# EAGLE design HominiPulseSensor (EAGLE 8.0.1)
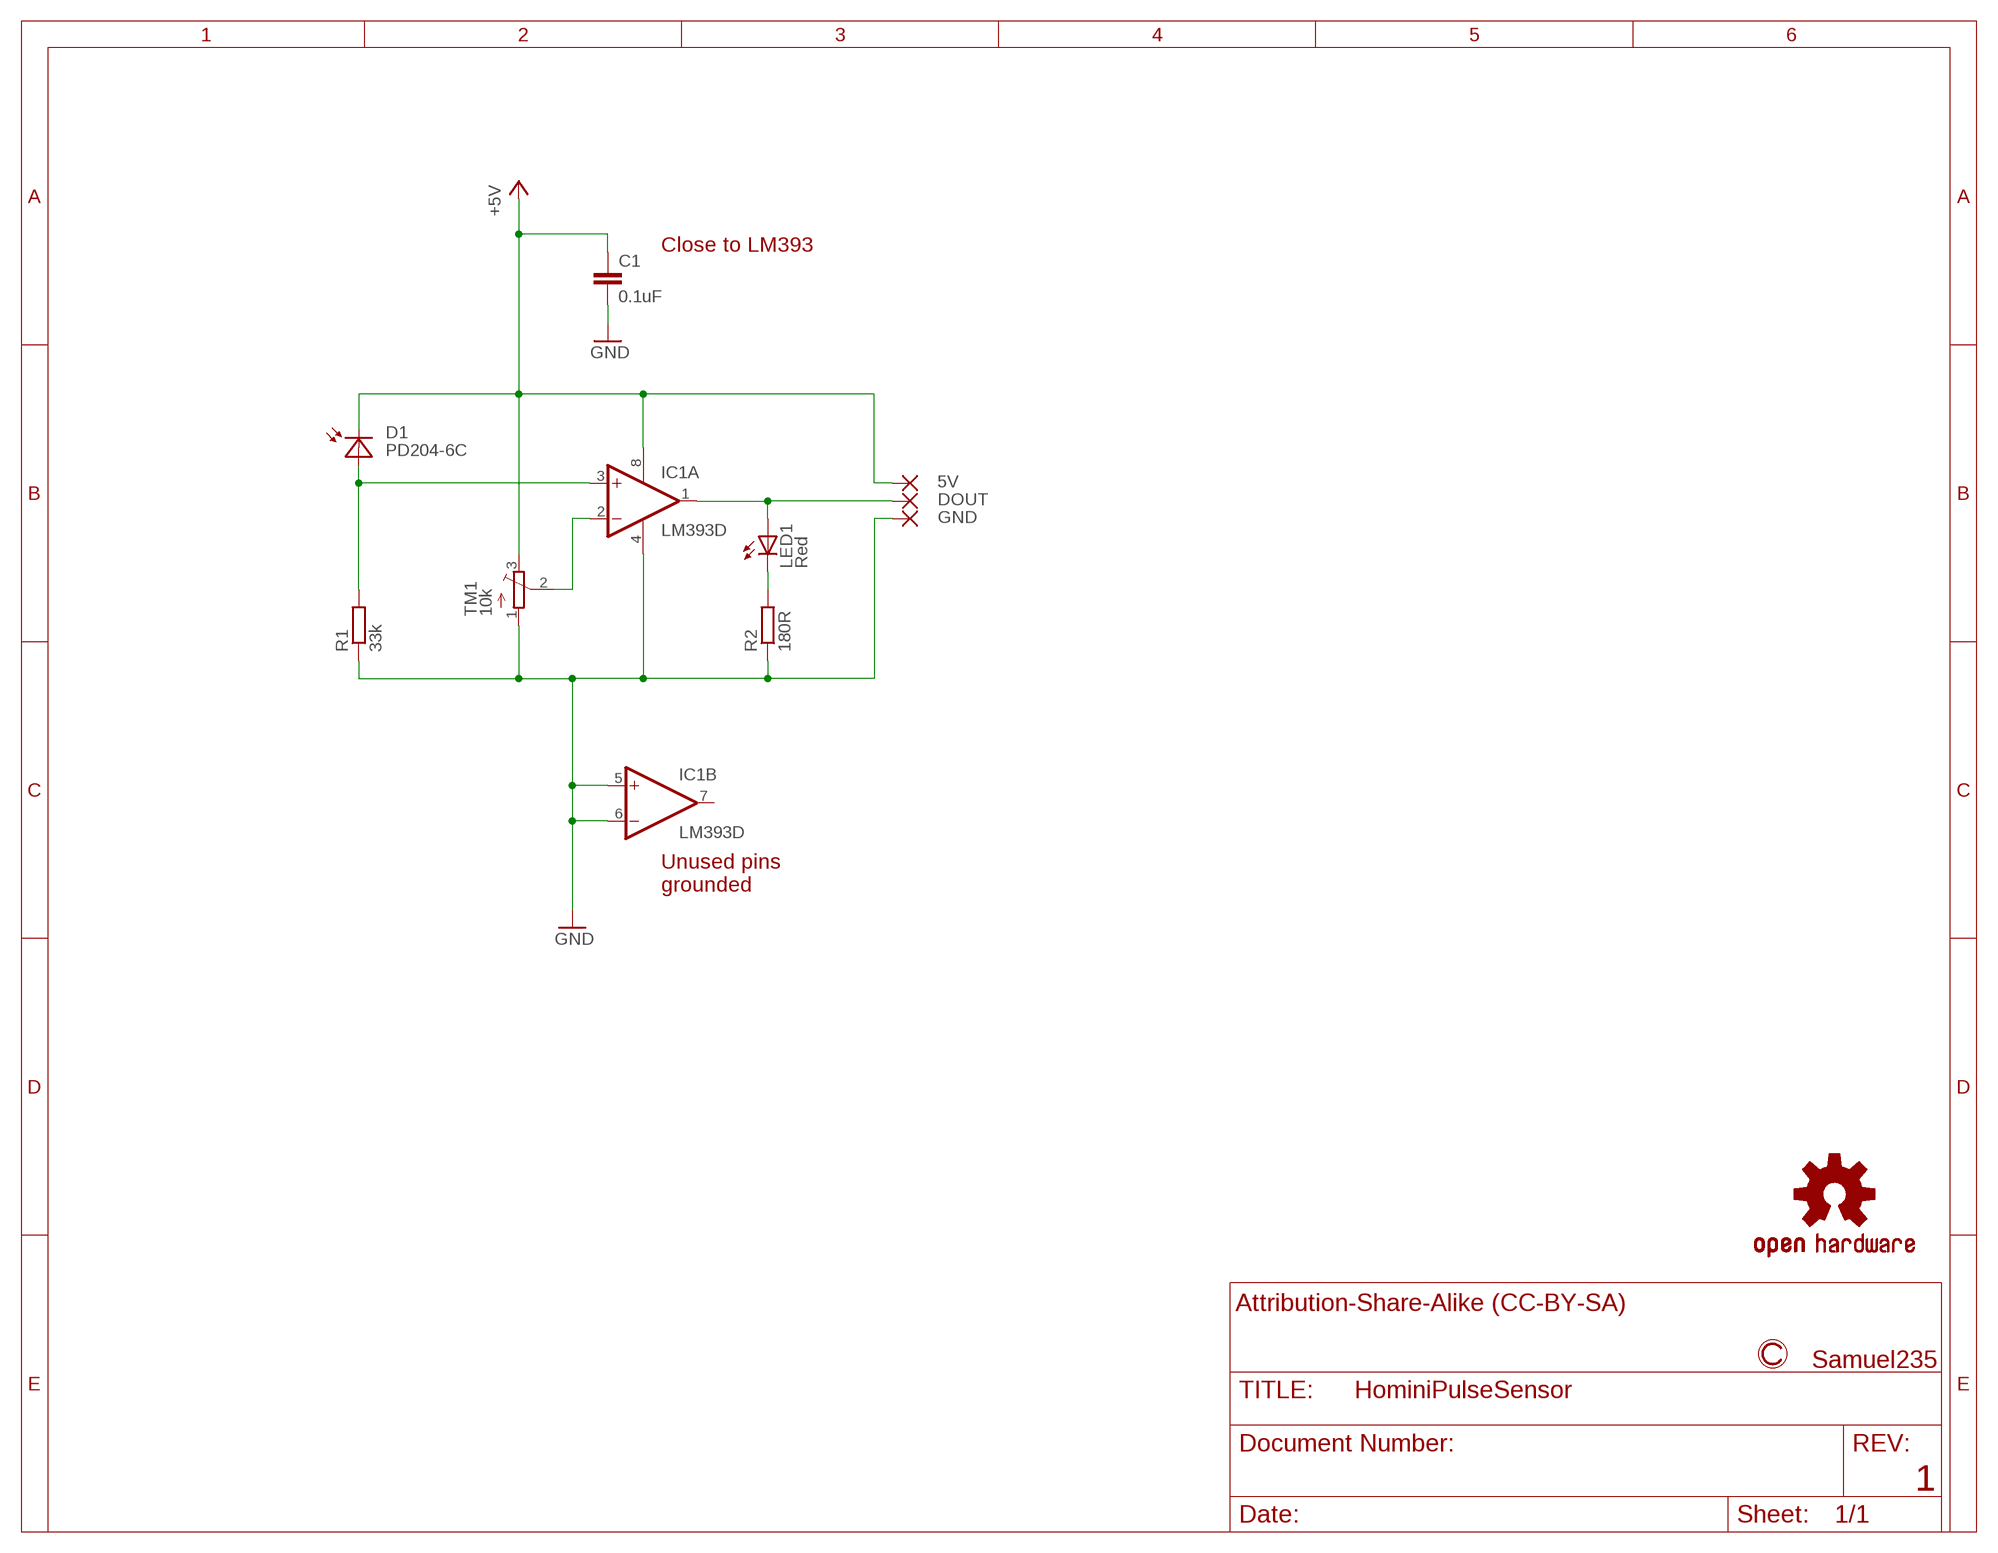
[diagram p0: schematic, sheet 1]

## Parts
5V  SMD2  [SMD1,27-2,54]
C1  0.1uF  C-EUC0603  [C0603]
D1  PD204-6C  [3MM-PTH]
DOUT  SMD2  [SMD1,27-2,54]
GND  SMD2  [SMD1,27-2,54]
IC1  LM393D  [SO08]
LED1  Red  LED3MM  [LED3MM]
LOGO1  OSHW-LOGOS  [OSHW-LOGO-S]
R1  33k  R-EU_R0603  [R0603]
R2  180R  R-EU_R0603  [R0603]
TM1  10k  TRIMPOTTC33X  [TC33X]

## Nets
+5V: 5V.1(P) C1.1 D1.C IC1.8(P:V+) TM1.3(E)
GND: C1.2 GND.1(P) IC1.4(P:V-) IC1.5(B:+IN) IC1.6(B:-IN) R1.1 R2.1 TM1.1(A)
N$1: D1.A IC1.3(A:+IN) R1.2
N$2: IC1.2(A:-IN) TM1.2(S)
N$4: DOUT.1(P) IC1.1(A:OUT) LED1.A
N$5: LED1.K(C) R2.2
Unconnected: IC1.7(B:OUT)

## Notes on the sheet
- Close to LM393
- Unused pins 
  grounded
- Attribution-Share-Alike (CC-BY-SA)
- Samuel235
- 1

## Library data of the parts
5V DOUT GND = wirepad:SMD2: SMD PAD
C1 = rcl:C-EU: CAPACITOR, European symbol
D1 = Misc:PD204-6C
IC1 = linear:LM393: COMPARATOR
LED1 = led:LED: LED OSRAM: - CHIPLED LG R971, LG N971, LY N971, LG Q971, LY Q971, LO R971, LY R971 LH N974, LH R974 LS Q976, LO Q976, LY Q976 LO Q996 - Hyper CHIPLED LW Q18S LB Q993, LB Q99A, LB R99A - SideLED LS A670, LO A670, LY A670, LG A670, LP A670 LB A673, LV A673, LT A673, LW A673 LH A674 LY A675 LS A676, LA A676, LO A676, LY A676, LW A676 LS A679, LY A679, LG A679 - Hyper Micro SIDELED® LS Y876, LA Y876, LO Y876, LY Y876 LT Y87S - SmartLED LW L88C, LW L88S LB L89C, LB L89S, LG L890 LS L89K, LO L89K, LY L89K LS L896, LA L896, LO L896, LY L896 - TOPLED LS T670, LO T670, LY T670, LG T670, LP T670 LSG T670, LSP T670, LSY T670, LOP T670, LYG T670 LG T671, LOG T671, LSG T671 LB T673, LV T673, LT T673, LW T673 LH T674 LS T676, LA T676, LO T676, LY T676, LB T676, LH T676, LSB T676, LW T676 LB T67C, LV T67C, LT T67C, LS T67K, LO T67K, LY T67K, LW E67C LS E67B, LA E67B, LO E67B, LY E67B, LB E67C, LV E67C, LT E67C LW T67C LS T679, LY T679, LG T679 LS T770, LO T770, LY T770, LG T770, LP T770 LB T773, LV T773, LT T773, LW T773 LH T774 LS E675, LA E675, LY E675, LS T675 LS T776, LA T776, LO T776, LY T776, LB T776 LHGB T686 LT T68C, LB T68C - Hyper Mini TOPLED® LB M676 - Mini TOPLED Santana® LG M470 LS M47K, LO M47K, LY M47K Source: http://www.osram.convergy.de LUXEON: - LUMILED® LXK2-PW12-R00, LXK2-PW12-S00, LXK2-PW14-U00, LXK2-PW14-V00 LXK2-PM12-R00, LXK2-PM12-S00, LXK2-PM14-U00 LXK2-PE12-Q00, LXK2-PE12-R00, LXK2-PE12-S00, LXK2-PE14-T00, LXK2-PE14-U00 LXK2-PB12-K00, LXK2-PB12-L00, LXK2-PB12-M00, LXK2-PB14-N00, LXK2-PB14-P00, LXK2-PB14-Q00 LXK2-PR12-L00, LXK2-PR12-M00, LXK2-PR14-Q00, LXK2-PR14-R00 LXK2-PD12-Q00, LXK2-PD12-R00, LXK2-PD12-S00 LXK2-PH12-R00, LXK2-PH12-S00 LXK2-PL12-P00, LXK2-PL12-Q00, LXK2-PL12-R00 Source: www.luxeon.com KINGBRIGHT: KA-3528ASYC Source: www.kingbright.com
LOGO1 = SparkFun-Aesthetics:OSHW-LOGO: Open-Source Hardware (OSHW) Logo This logo indicates the piece of hardware it is found on incorporates a OSHW license and/or adheres to the definition of open source hardware found here: http://freedomdefined.org/OSHW
R1 R2 = rcl:R-EU_: RESISTOR, European symbol
TM1 = adafruit:TRIMPOT: SMT trimmer potentiometer part number TC33X http://www.ladyada.net/library/eagle

## Board
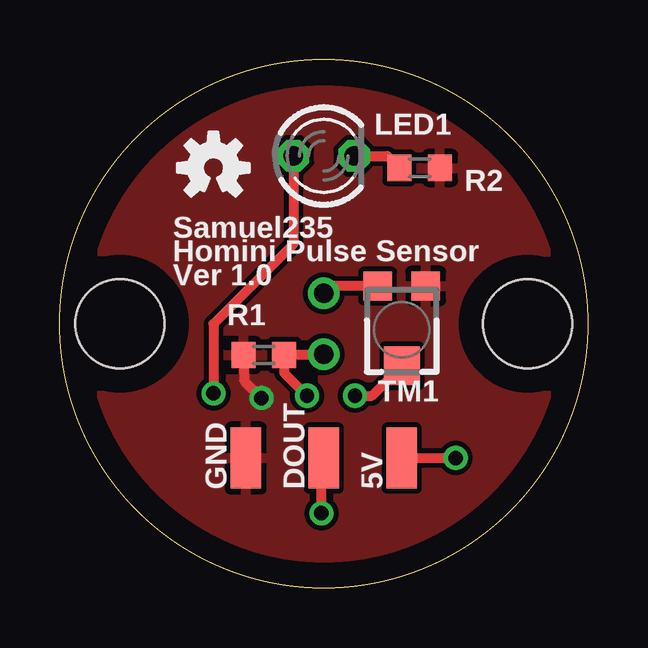
[diagram p1: board, top side]
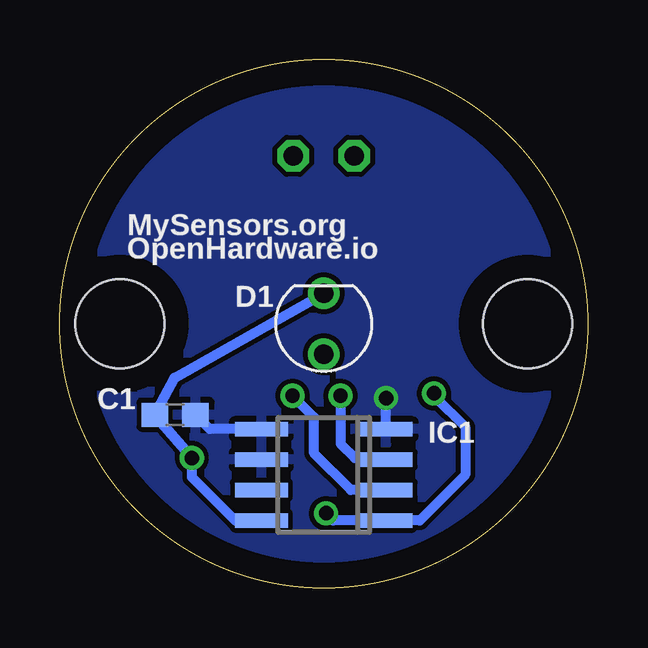
[diagram p2: board, bottom side, seen from below]

Size 22 x 22 mm. Coordinates in mm from the lower left corner, seen from the top.
Outline: circle at 11,11 radius 11
Copper layers (1*16): Top 0.035mm / dielectric 1.5mm / Bottom 0.035mm
Design rules "default *": minimum track width 10mil, minimum drill 0.3mm, track to track 8mil, track to pad 8mil, pad to pad 8mil, via to via 8mil, smd to smd 8mil, copper to edge 40mil, drill to drill 8mil, minimum pad ring 10mil, minimum via ring 8mil, stop-mask expansion 4mil, vias tented up to drill 0mil, thermal gap 10mil
Holes 3.7 mm at 2.5,11 19.5,11

### Footprints (pad centres in the part's own frame; a part is rotated, then mirrored left to right if it is on the bottom)
SMD1,27-2,54 = smd 1.27 x 2.54: 1 0,0
C0603 = smd 1.1 x 1: 1 -0.85,0; 2 0.85,0
3MM-PTH = drill 0.8: A -1.27,0; C 1.27,0
SO08 = smd 0.6 x 2.2: 1 -1.905,-2.6; 2 -0.635,-2.6; 3 0.635,-2.6; 4 1.905,-2.6; 5 1.905,2.6; 6 0.635,2.6; 7 -0.635,2.6; 8 -1.905,2.6
LED3MM = drill 0.813 octagon: A -1.27,0; K 1.27,0
R0603 = smd 1 x 1.1: 1 -0.85,0; 2 0.85,0
TC33X = smd 1.2 x 1.2: 1 -1,-1.825; 3 1,-1.825 | smd 1.5 x 1.6: 2 0,1.5

### Placement (x,y rotation side)
5V  14.25,5.4 0 top
C1  17.2,7.2 0 bottom
D1  11,11 90 bottom
DOUT  11,5.4 0 top
GND  7.75,5.4 0 top
IC1  11,4.7 90 bottom
LED1  11,18 0 top
LOGO1  6.4,17.5 0 top
R1  8.5,9.7 0 top
R2  15,17.5 180 top
TM1  14.25,10.75 180 top

### Tracks (layer width: path | path; a pad name or v marks a point on that pad's centre or on a via)
+5V  (via drill 0.6)
  Top 0.406: 5V.1 v16.5,5.4 | TM1.3 11.3,12.57 D1.C
  Bottom 0.406: IC1.8 14.7,2.79 16.5,4.6 v16.5,5.4 C1.1 17.22,8.75 D1.C
GND  (via drill 0.6)
  Top 0.406: v8.4,7.9 7.7,8.6 7.7,9.65 R1.1
  Bottom 0.406: IC1.4 v8.4,7.9 | IC1.5 15.76,6.61 C1.2
  pour Top: 2.3,18 4.3,19.8 6.5,21 8.7,21.7 11.6,21.9 14.2,21.5 16.2,20.7 18.1,19.4 19.4,18 20.7,16.2 21.5,14.5 21.9,12.4 22,10.2 21.7,8.2 21,6.3 19.9,4.4 18.6,3 16,1.2 13.8,0.3 11.2,-0.1 8.3,0.2 6.1,1 4.6,1.9 3,3.3 1.2,5.9 0.4,8.1 0,11 0.3,13.6 1.2,16
  pour Bottom: 2.8,18.5 4.6,20 6.6,21 8.4,21.7 10.7,22 13.4,21.7 16,20.8 17.9,19.6 19.3,18.2 20.7,16.2 21.6,14 22,11.6 21.9,9.5 21.5,7.6 20.6,5.4 19.8,4.3 18.9,3.4 17.1,1.8 15.5,1 13.5,0.2 11,0 8.9,0.2 7,0.8 5.5,1.4 4.2,2.3 2.9,3.5 1.8,5 0.9,6.5 0.4,8.1 0,9.7 0,12.1 0.6,14.7 1.6,16.8
N$1  (via drill 0.6)
  Top 0.406: D1.A 10.97,9.7 R1.2 9.35,8.95 v10.3,8
  Bottom 0.406: v10.3,8 10.3,6 9.7,5.4 8.46,5.4 IC1.3
N$2  (via drill 0.6)
  Top 0.406: v12.3,8 13,8 TM1.2
  Bottom 0.406: IC1.2 9.87,4.07 11.4,5.6 11.4,7.1 v12.3,8
N$4  (via drill 0.6)
  Top 0.406: v10.9,3.1 10.9,5.3 DOUT.1 | LED1.A 9.73,14.33 6.4,11 v6.4,8.1
  Bottom 0.406: v10.9,3.1 10.6,2.79 IC1.1 7,2.8 5.1,4.7 5.1,6.7 6.4,8 v6.4,8.1
N$5
  Top 0.406: LED1.K 13.65,18 R2.2

### Text on the board
tNames: Samuel235 / Homini Pulse Sensor / Ver 1.0
bNames: MySensors.org / OpenHardware.io